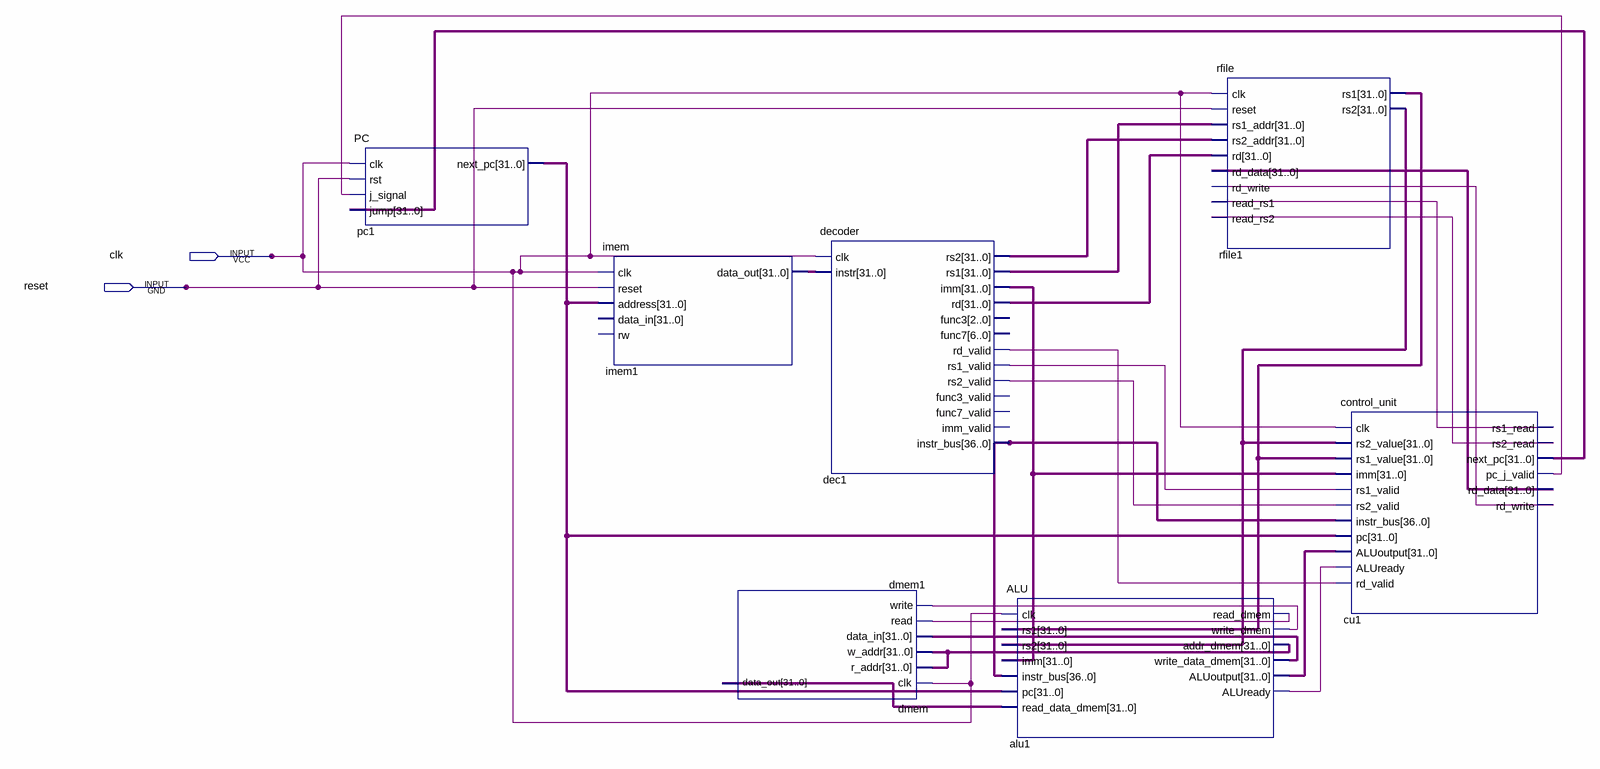
[diagram p0: schematic sheet]
// Quartus schematic RISC_V.bdf as structural Verilog: 7 symbols, 2 pins
module RISC_V (
  input  clk,
  input  reset
);

  wire alu1_aluready, alu1_read_dmem, alu1_write_dmem, cu1_pc_j_valid, cu1_rd_write, cu1_rs1_read,
       cu1_rs2_read, dec1_rd_valid, dec1_rs1_valid, dec1_rs2_valid;
  wire [31:0] alu1_addr_dmem, alu1_aluoutput, alu1_write_data_dmem, cu1_next_pc, cu1_rd_data, dec1_imm,
       dec1_rd, dec1_rs1, dec1_rs2, dmem1_data_out, imem1_data_out, pc1_next_pc, rfile1_rs1, rfile1_rs2;
  wire [36:0] dec1_instr_bus;

  PC pc1 (.clk(clk), .rst(reset), .j_signal(cu1_pc_j_valid), .jump(cu1_next_pc), .next_pc(pc1_next_pc));
  imem imem1 (.clk(clk), .reset(reset), .address(pc1_next_pc), .data_out(imem1_data_out));  // open: data_in, rw
  dmem dmem1 (
    .clk(clk), .r_addr(alu1_addr_dmem), .w_addr(alu1_addr_dmem), .data_in(alu1_write_data_dmem),
    .read(alu1_read_dmem), .write(alu1_write_dmem), .data_out(dmem1_data_out));
  decoder dec1 (
    .clk(clk), .instr(imem1_data_out), .rs2(dec1_rs2), .rs1(dec1_rs1), .imm(dec1_imm), .rd(dec1_rd),
    .rd_valid(dec1_rd_valid), .rs1_valid(dec1_rs1_valid), .rs2_valid(dec1_rs2_valid),
    .instr_bus(dec1_instr_bus));  // open: func3, func7, func3_valid, func7_valid, imm_valid
  ALU alu1 (
    .clk(clk), .rs1(rfile1_rs1), .rs2(rfile1_rs2), .imm(dec1_imm), .instr_bus(dec1_instr_bus),
    .pc(pc1_next_pc), .read_data_dmem(dmem1_data_out), .read_dmem(alu1_read_dmem),
    .write_dmem(alu1_write_dmem), .addr_dmem(alu1_addr_dmem), .write_data_dmem(alu1_write_data_dmem),
    .ALUoutput(alu1_aluoutput), .ALUready(alu1_aluready));
  rfile rfile1 (
    .clk(clk), .reset(reset), .rs1_addr(dec1_rs1), .rs2_addr(dec1_rs2), .rd(dec1_rd), .rd_data(cu1_rd_data),
    .rd_write(cu1_rd_write), .read_rs1(cu1_rs1_read), .read_rs2(cu1_rs2_read), .rs1(rfile1_rs1),
    .rs2(rfile1_rs2));
  control_unit cu1 (
    .clk(clk), .rs2_value(rfile1_rs2), .rs1_value(rfile1_rs1), .imm(dec1_imm), .rs1_valid(dec1_rs1_valid),
    .rs2_valid(dec1_rs2_valid), .instr_bus(dec1_instr_bus), .pc(pc1_next_pc), .ALUoutput(alu1_aluoutput),
    .ALUready(alu1_aluready), .rd_valid(dec1_rd_valid), .rs1_read(cu1_rs1_read), .rs2_read(cu1_rs2_read),
    .next_pc(cu1_next_pc), .pc_j_valid(cu1_pc_j_valid), .rd_data(cu1_rd_data), .rd_write(cu1_rd_write));
endmodule
